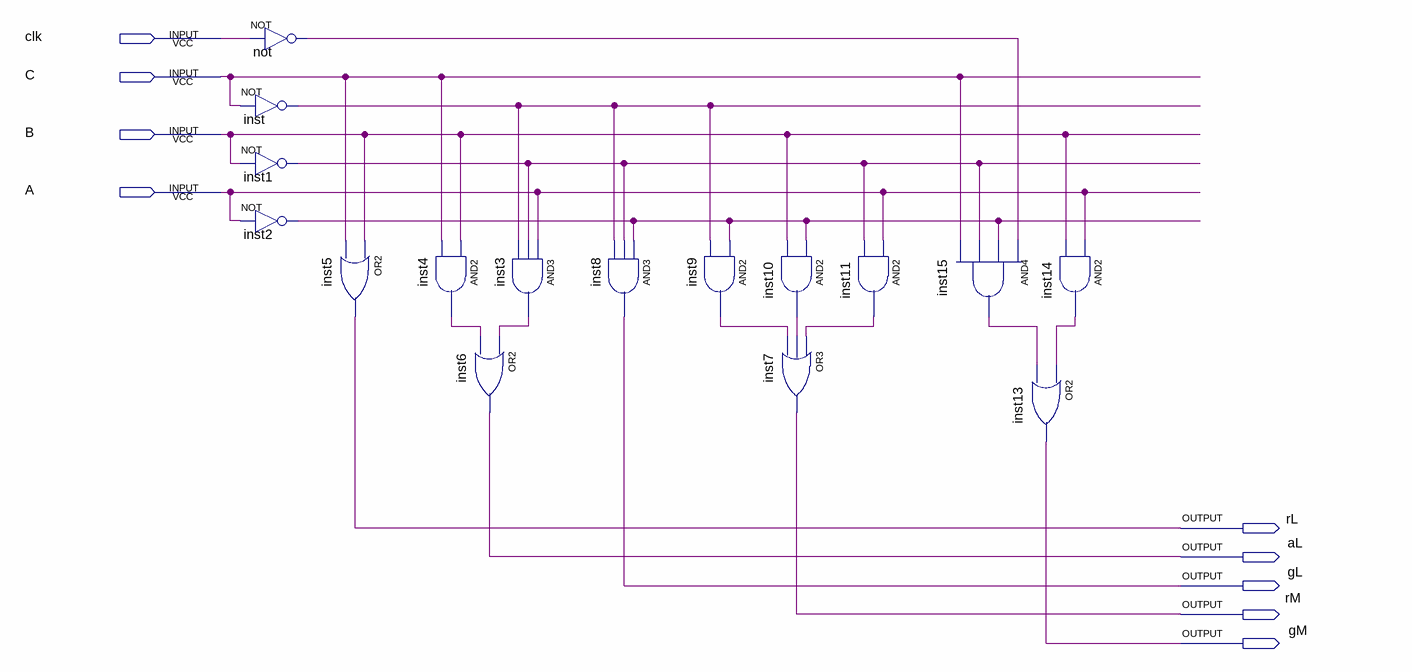
[diagram p0: schematic sheet]
// Quartus schematic TLD.bdf as structural Verilog: 16 symbols, 9 pins
module TLD (
  input  clk,
  input  C,
  input  B,
  input  A,
  output rL,
  output aL,
  output gL,
  output rM,
  output gM
);

  wire inst1_out, inst2_out, inst3_out, inst4_out, inst9_out, inst10_out, inst11_out, inst14_out, inst15_out,
       inst_out, not_out;

  not \not  (not_out, clk);
  not inst (inst_out, C);
  not inst1 (inst1_out, B);
  not inst2 (inst2_out, A);
  or inst5 (rL, B, C);
  and inst4 (inst4_out, B, C);
  and inst3 (inst3_out, A, inst1_out, inst_out);
  or inst6 (aL, inst3_out, inst4_out);
  and inst8 (gL, inst2_out, inst1_out, inst_out);
  and inst9 (inst9_out, inst2_out, inst_out);
  and inst10 (inst10_out, inst2_out, B);
  or inst7 (rM, inst11_out, inst10_out, inst9_out);
  and inst11 (inst11_out, A, inst1_out);
  and inst15 (inst15_out, not_out, inst2_out, inst1_out, C);
  and inst14 (inst14_out, A, B);
  or inst13 (gM, inst14_out, inst15_out);
endmodule
